# EAGLE design 8-Bit Instruction Register Part 3 (EAGLE 7.5.0)
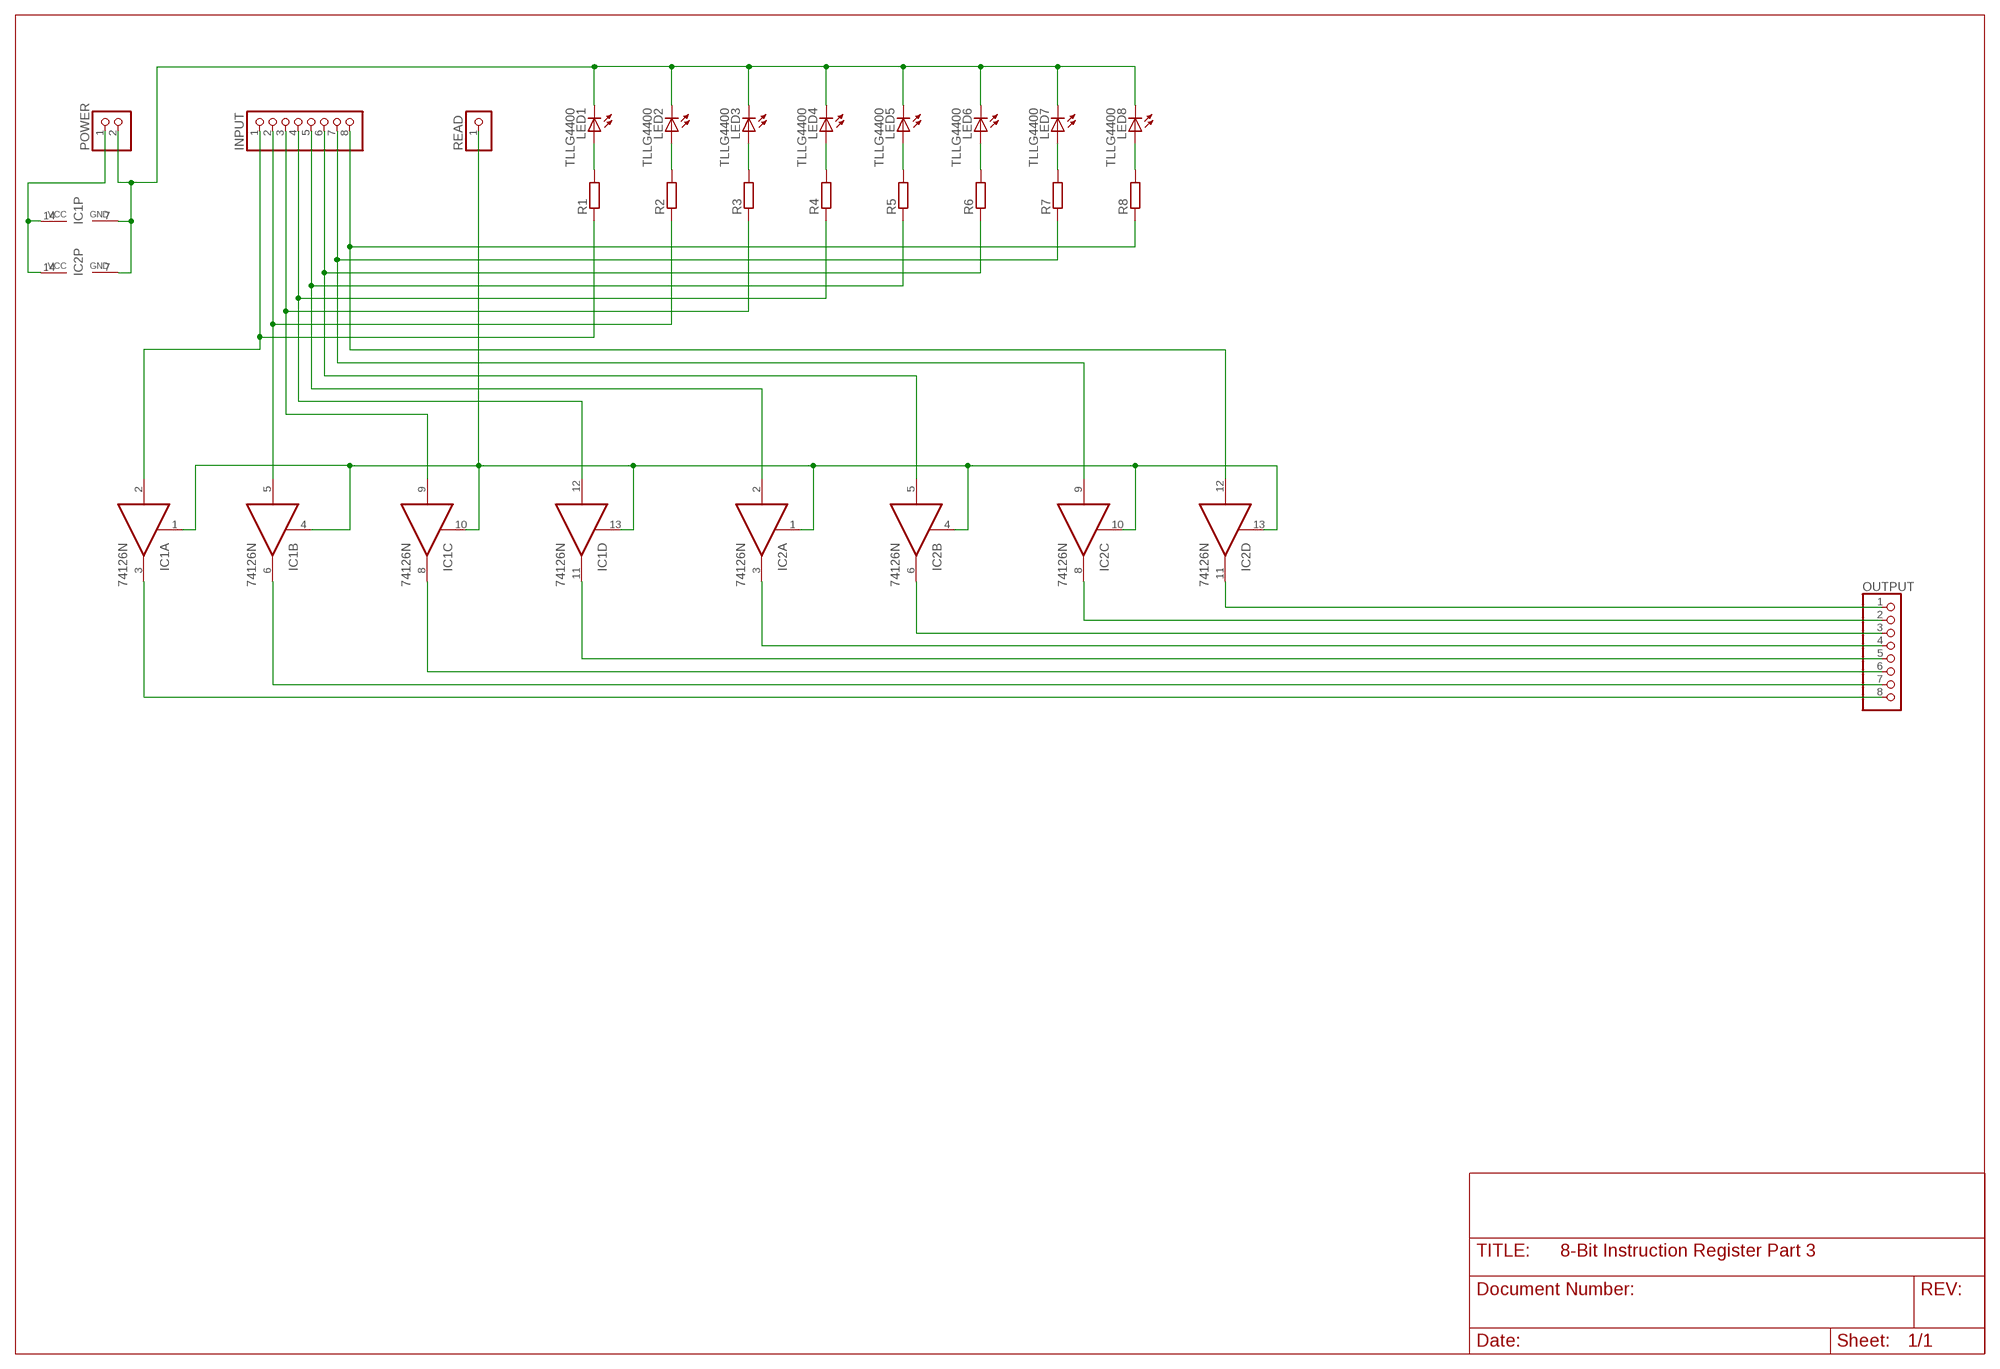
[diagram p0: schematic, sheet 1]

## Parts
IC1  74126N  [DIL14]
IC2  74126N  [DIL14]
INPUT  PINHD-1X8  [1X08]
LED1  TLLG4400  [LED3MM]
LED2  TLLG4400  [LED3MM]
LED3  TLLG4400  [LED3MM]
LED4  TLLG4400  [LED3MM]
LED5  TLLG4400  [LED3MM]
LED6  TLLG4400  [LED3MM]
LED7  TLLG4400  [LED3MM]
LED8  TLLG4400  [LED3MM]
OUTPUT  PINHD-1X8  [1X08]
POWER  PINHD-1X2  [1X02]
R1  R-EU_0207/7  [0207/7]
R2  R-EU_0207/7  [0207/7]
R3  R-EU_0207/7  [0207/7]
R4  R-EU_0207/7  [0207/7]
R5  R-EU_0207/7  [0207/7]
R6  R-EU_0207/7  [0207/7]
R7  R-EU_0207/7  [0207/7]
R8  R-EU_0207/7  [0207/7]
READ  PINHD-1X1  [1X01]

## Nets
GND: IC1.7(P:GND) IC2.7(P:GND) LED1.K(C) LED2.K(C) LED3.K(C) LED4.K(C) LED5.K(C) LED6.K(C) LED7.K(C) LED8.K(C) POWER.2
N$1: IC1.2(A:I) INPUT.1 R1.1
N$2: IC1.5(B:I) INPUT.2 R2.1
N$3: IC1.9(C:I) INPUT.3 R3.1
N$4: IC1.12(D:I) INPUT.4 R4.1
N$5: IC2.2(A:I) INPUT.5 R5.1
N$6: IC2.5(B:I) INPUT.6 R6.1
N$7: IC2.9(C:I) INPUT.7 R7.1
N$8: IC2.12(D:I) INPUT.8 R8.1
N$9: LED1.A R1.2
N$10: IC1.1(A:OE) IC1.4(B:OE) IC1.10(C:OE) IC1.13(D:OE) IC2.1(A:OE) IC2.4(B:OE) IC2.10(C:OE) IC2.13(D:OE) READ.1
N$11: IC1.3(A:O) OUTPUT.8
N$12: IC1.6(B:O) OUTPUT.7
N$13: IC1.8(C:O) OUTPUT.6
N$14: IC1.11(D:O) OUTPUT.5
N$15: IC2.3(A:O) OUTPUT.4
N$16: IC2.6(B:O) OUTPUT.3
N$17: IC2.8(C:O) OUTPUT.2
N$18: IC2.11(D:O) OUTPUT.1
N$19: LED2.A R2.2
N$20: LED3.A R3.2
N$21: LED4.A R4.2
N$22: LED5.A R5.2
N$23: LED6.A R6.2
N$24: LED7.A R7.2
N$25: LED8.A R8.2
VCC: IC1.14(P:VCC) IC2.14(P:VCC) POWER.1

## Library data of the parts
IC1 IC2 = 74xx-eu:74*126: Quad bus BUFFER, 3-state
INPUT OUTPUT = pinhead:PINHD-1X8: PIN HEADER
LED1-LED8 = led:TLLG4400: Low Current (2mA) LED 3 mm Tinted Diffused Package color GREEN Source: Data sheet <http://www.farnell.com/datasheets/391098.pdf>; MF: VISHAY SEMICONDUCTOR; OC_FARNELL: 1612435
POWER = pinhead:PINHD-1X2: PIN HEADER
R1-R8 = resistor:R-EU_: RESISTOR, European symbol
READ = pinhead:PINHD-1X1: PIN HEADER

## Board
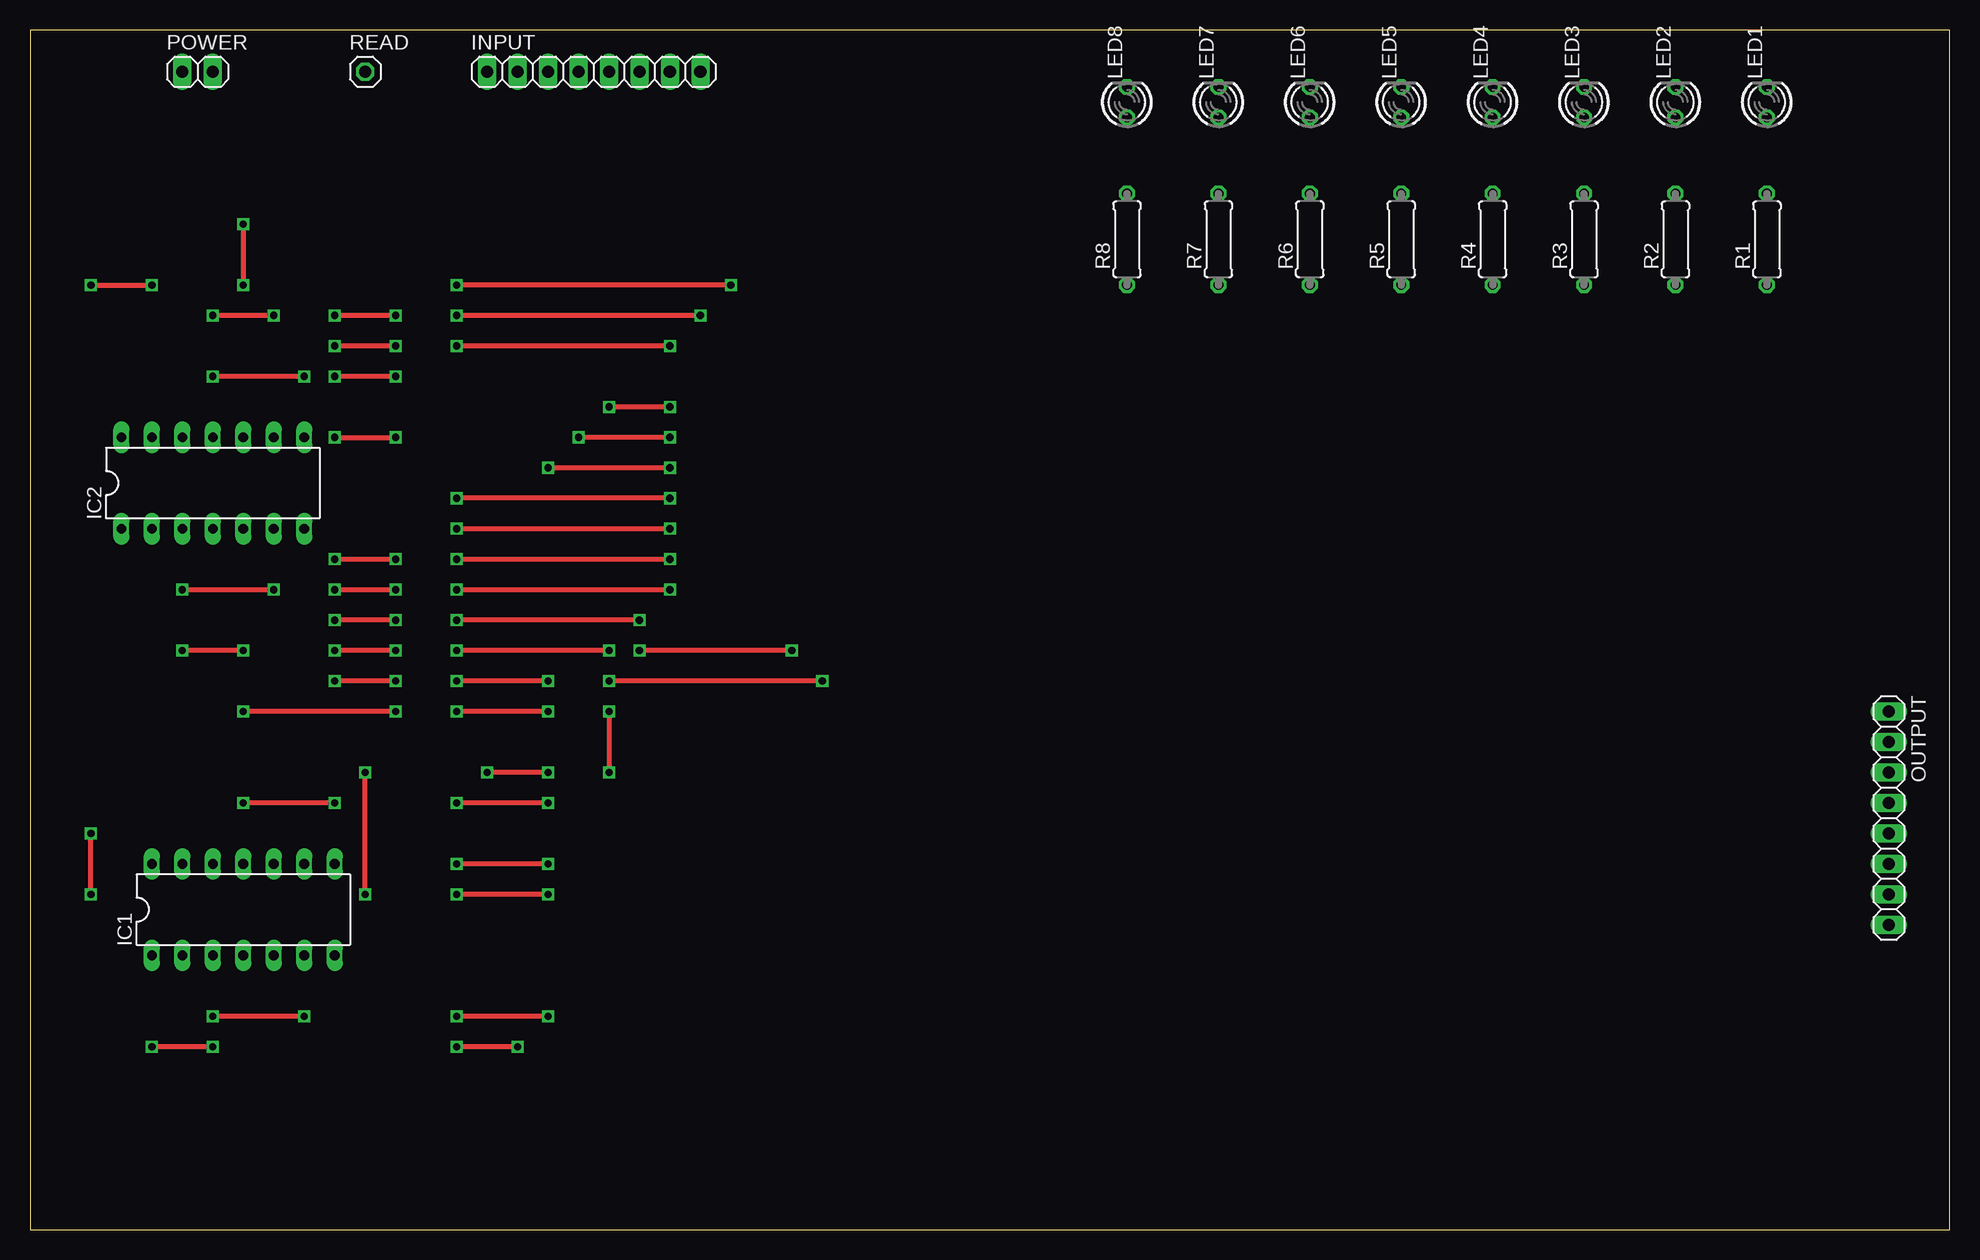
[diagram p1: board, top side]
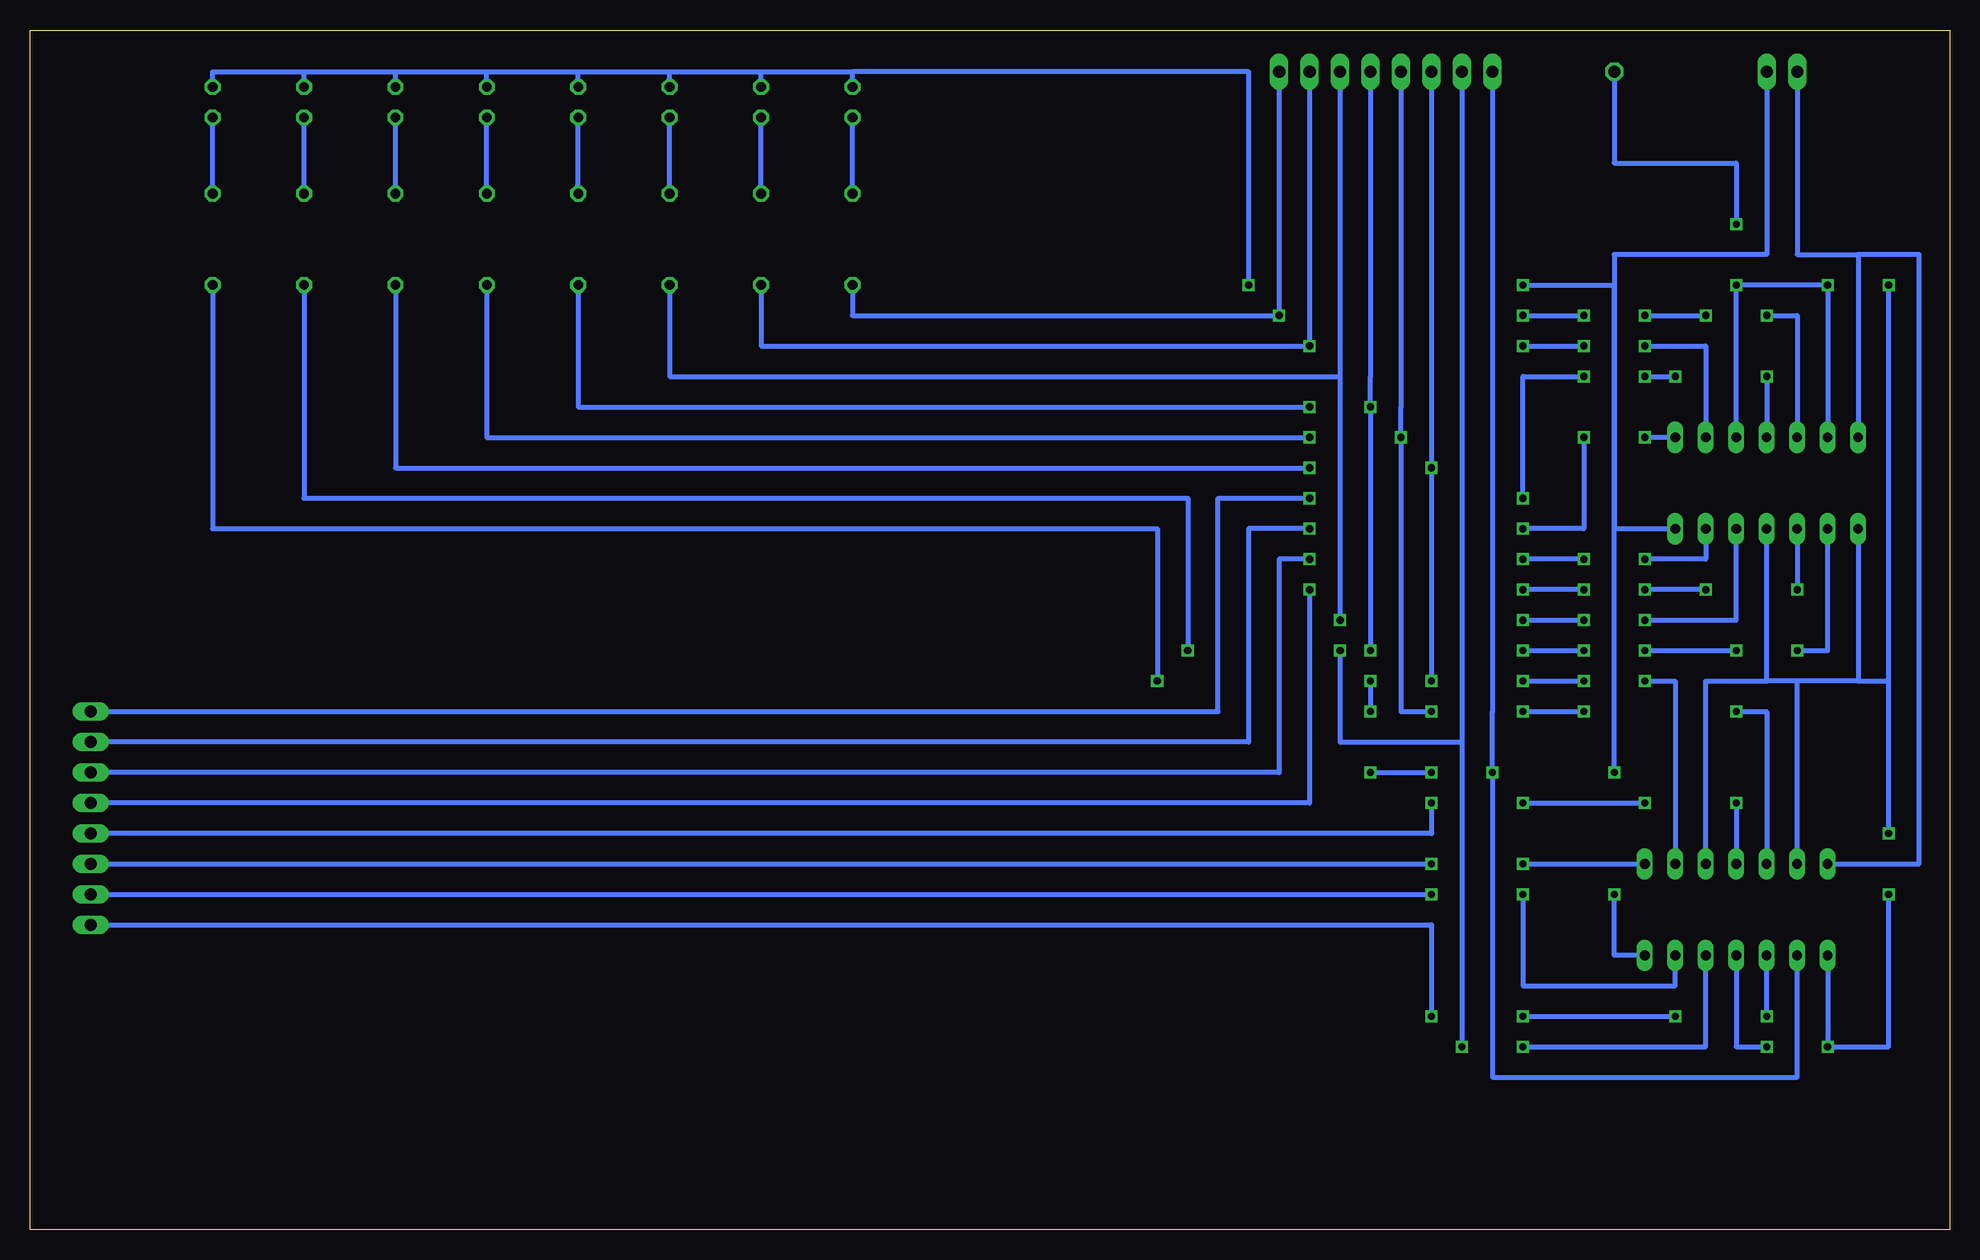
[diagram p2: board, bottom side, seen from below]

Size 160 x 100 mm. Coordinates in mm from the lower left corner, seen from the top.
Outline: 0,0 160,0 160,100 0,100 0,0
Copper layers (1*16): Top 0.035mm / dielectric 1.5mm / Bottom 0.035mm
Design rules "default": minimum track width 10mil, minimum drill 24mil, track to track 8mil, track to pad 8mil, pad to pad 8mil, via to via 8mil, smd to smd 8mil, copper to edge 40mil, drill to drill 8mil, minimum pad ring 10mil, minimum via ring 8mil, stop-mask expansion 4mil, vias tented up to drill 0mil, thermal gap 10mil

### Footprints (pad centres in the part's own frame; a part is rotated, then mirrored left to right if it is on the bottom)
DIL14 = drill 0.813 long: 1 -7.62,-3.81; 2 -5.08,-3.81; 3 -2.54,-3.81; 4 0,-3.81; 5 2.54,-3.81; 6 5.08,-3.81; 7 7.62,-3.81; 8 7.62,3.81; 9 5.08,3.81; 10 2.54,3.81; 11 0,3.81; 12 -2.54,3.81; 13 -5.08,3.81; 14 -7.62,3.81
1X08 = drill 1.016 long: 1 -8.89,0; 2 -6.35,0; 3 -3.81,0; 4 -1.27,0; 5 1.27,0; 6 3.81,0; 7 6.35,0; 8 8.89,0
LED3MM = drill 0.813 octagon: A -1.27,0; K 1.27,0
1X02 = drill 1.016 long: 1 -1.27,0; 2 1.27,0
0207/7 = drill 0.813 octagon: 1 -3.81,0; 2 3.81,0
1X01 = drill 1.016 octagon: 1 0,0

### Placement (x,y rotation side)
IC1  17.78,26.67 0 top
IC2  15.24,62.23 0 top
INPUT  46.99,96.52 0 top
LED1  144.78,93.98 90 top
LED2  137.16,93.98 90 top
LED3  129.54,93.98 90 top
LED4  121.92,93.98 90 top
LED5  114.3,93.98 90 top
LED6  106.68,93.98 90 top
LED7  99.06,93.98 90 top
LED8  91.44,93.98 90 top
OUTPUT  154.94,34.29 270 top
POWER  13.97,96.52 0 top
R1  144.78,82.55 90 top
R2  137.16,82.55 90 top
R3  129.54,82.55 90 top
R4  121.92,82.55 90 top
R5  114.3,82.55 90 top
R6  106.68,82.55 90 top
R7  99.06,82.55 90 top
R8  91.44,82.55 90 top
READ  27.94,96.52 0 top

### Tracks (layer width: path | path; a pad name or v marks a point on that pad's centre or on a via)
GND  (via drill 0.6)
  Top 0.406: v27.94,27.94 v27.94,38.1 | v58.42,78.74 v35.56,78.74
  Bottom 0.406: 27.94,78.74 27.94,81.28 15.24,81.28 POWER.2 | v27.94,38.1 27.94,78.74 | LED1.K 144.78,96.52 137.16,96.52 | 137.16,96.52 129.54,96.52 | 129.54,96.52 121.92,96.52 | 121.92,96.52 114.3,96.52 | 114.3,96.52 106.68,96.52 | 106.68,96.52 99.06,96.52 | 99.06,96.52 93.98,96.52 91.44,96.52 | v58.42,78.74 58.42,96.52 91.44,96.52 | v35.56,78.74 27.94,78.74 | LED8.K 91.44,96.52 | LED7.K 99.06,96.52 | LED6.K 106.68,96.52 | LED5.K 114.3,96.52 | LED4.K 121.92,96.52 | LED3.K 129.54,96.52 | LED2.K 137.16,96.52 | IC1.7 27.94,22.86 v27.94,27.94 | 27.94,78.74 27.94,58.42 IC2.7
N$1  (via drill 0.6)
  Top 0.406: v66.04,45.72 v48.26,45.72 | v48.26,43.18 v48.26,38.1 | v43.18,38.1 v38.1,38.1
  Bottom 0.406: INPUT.1 38.1,43.18 v38.1,38.1 38.1,12.7 12.7,12.7 IC1.2 | R1.1 144.78,58.42 66.04,58.42 v66.04,45.72 | v48.26,45.72 v48.26,43.18 | v48.26,38.1 v43.18,38.1
N$2  (via drill 0.6)
  Top 0.406: v40.64,15.24 v35.56,15.24 | v63.5,48.26 v50.8,48.26
  Bottom 0.406: INPUT.2 40.64,40.64 | 40.64,40.64 v40.64,15.24 | v35.56,15.24 20.32,15.24 IC1.5 | R2.1 137.16,60.96 63.5,60.96 v63.5,48.26 | v50.8,48.26 50.8,40.64 40.64,40.64
N$3  (via drill 0.6)
  Top 0.406: v43.18,45.72 v35.56,45.72 | v30.48,45.72 v25.4,45.72 | v53.34,63.5 v43.18,63.5
  Bottom 0.406: INPUT.3 v43.18,63.5 v43.18,45.72 | v35.56,45.72 v30.48,45.72 | v25.4,45.72 22.86,45.72 IC1.9 | R3.1 129.54,63.5 v53.34,63.5
N$4  (via drill 0.6)
  Top 0.406: v43.18,43.18 v35.56,43.18 | v30.48,43.18 v17.78,43.18 | v53.34,66.04 v45.72,66.04
  Bottom 0.406: INPUT.4 45.72,68.58 v45.72,66.04 45.72,43.18 v43.18,43.18 | v35.56,43.18 v30.48,43.18 | v17.78,43.18 15.24,43.18 IC1.12 | R4.1 121.92,66.04 v53.34,66.04
N$5  (via drill 0.6)
  Top 0.406: v48.26,48.26 v35.56,48.26 | v30.48,48.26 v25.4,48.26 | v17.78,48.26 v12.7,48.26 | v53.34,68.58 v48.26,68.58
  Bottom 0.406: INPUT.5 48.26,71.12 v48.26,68.58 v48.26,48.26 | v35.56,48.26 v30.48,48.26 | v25.4,48.26 v17.78,48.26 | v12.7,48.26 10.16,48.26 IC2.2 | R5.1 114.3,68.58 v53.34,68.58
N$6  (via drill 0.6)
  Top 0.406: v50.8,50.8 v35.56,50.8 | v30.48,50.8 v25.4,50.8
  Bottom 0.406: INPUT.6 50.8,71.12 | 50.8,71.12 v50.8,50.8 | v35.56,50.8 v30.48,50.8 | v25.4,50.8 17.78,50.8 IC2.5 | R6.1 106.68,71.12 50.8,71.12
N$7  (via drill 0.6)
  Top 0.406: v53.34,73.66 v35.56,73.66 | v30.48,73.66 v25.4,73.66
  Bottom 0.406: INPUT.7 v53.34,73.66 99.06,73.66 R7.1 | v35.56,73.66 v30.48,73.66 | v25.4,73.66 20.32,73.66 IC2.9
N$8  (via drill 0.6)
  Top 0.406: v55.88,76.2 v35.56,76.2 | v30.48,76.2 v25.4,76.2 | v20.32,76.2 v15.24,76.2
  Bottom 0.406: v35.56,76.2 v30.48,76.2 | v25.4,76.2 v20.32,76.2 | v15.24,76.2 12.7,76.2 IC2.12 | INPUT.8 v55.88,76.2 91.44,76.2 R8.1
N$9
  Bottom 0.406: R1.2 LED1.A
N$10  (via drill 0.6)
  Top 0.406: v17.78,83.82 v17.78,78.74 | v5.08,78.74 v10.16,78.74 | v5.08,27.94 v5.08,33.02 | v15.24,15.24 v10.16,15.24
  Bottom 0.406: v17.78,83.82 17.78,88.9 27.94,88.9 READ.1 | IC2.13 v10.16,78.74 v17.78,78.74 IC2.10 | IC2.1 7.62,45.72 | 7.62,45.72 5.08,45.72 | 5.08,45.72 v5.08,78.74 | 7.62,45.72 12.7,45.72 | 12.7,45.72 15.24,45.72 | 15.24,45.72 IC2.4 | IC1.13 12.7,45.72 | IC1.10 20.32,45.72 15.24,45.72 | IC1.1 v10.16,15.24 5.08,15.24 v5.08,27.94 | v5.08,33.02 5.08,45.72 | IC1.4 17.78,15.24 v15.24,15.24
N$11  (via drill 0.6)
  Top 0.406: v43.18,17.78 v35.56,17.78 | v22.86,17.78 v15.24,17.78
  Bottom 0.406: OUTPUT.8 43.18,25.4 v43.18,17.78 | v35.56,17.78 v22.86,17.78 | v15.24,17.78 IC1.3
N$12  (via drill 0.6)
  Top 0.406: v43.18,27.94 v35.56,27.94
  Bottom 0.406: OUTPUT.7 v43.18,27.94 | v35.56,27.94 35.56,20.32 22.86,20.32 IC1.6
N$13  (via drill 0.6)
  Top 0.406: v43.18,30.48 v35.56,30.48
  Bottom 0.406: OUTPUT.6 v43.18,30.48 | v35.56,30.48 IC1.8
N$14  (via drill 0.6)
  Top 0.406: v25.4,35.56 v17.78,35.56 | v43.18,35.56 v35.56,35.56
  Bottom 0.406: v35.56,35.56 v25.4,35.56 | v17.78,35.56 IC1.11 | v43.18,35.56 43.18,33.02 OUTPUT.5
N$15  (via drill 0.6)
  Top 0.406: v12.7,53.34 v20.32,53.34 | v25.4,53.34 v30.48,53.34 | v35.56,53.34 v53.34,53.34
  Bottom 0.406: IC2.3 v12.7,53.34 | v20.32,53.34 v25.4,53.34 | v30.48,53.34 v35.56,53.34 | v53.34,53.34 53.34,35.56 OUTPUT.4
N$16  (via drill 0.6)
  Top 0.406: v25.4,55.88 v30.48,55.88 | v35.56,55.88 v53.34,55.88
  Bottom 0.406: IC2.6 20.32,55.88 v25.4,55.88 | v30.48,55.88 v35.56,55.88 | v53.34,55.88 55.88,55.88 55.88,38.1 OUTPUT.3
N$17  (via drill 0.6)
  Top 0.406: v25.4,66.04 v30.48,66.04 | v35.56,58.42 v53.34,58.42
  Bottom 0.406: IC2.8 v25.4,66.04 | v30.48,66.04 30.48,58.42 v35.56,58.42 | v53.34,58.42 58.42,58.42 58.42,40.64 OUTPUT.2
N$18  (via drill 0.6)
  Top 0.406: v53.34,60.96 v35.56,60.96 | v30.48,71.12 v25.4,71.12 | v22.86,71.12 v15.24,71.12
  Bottom 0.406: OUTPUT.1 60.96,43.18 60.96,60.96 v53.34,60.96 | v35.56,60.96 35.56,71.12 v30.48,71.12 | v25.4,71.12 v22.86,71.12 | v15.24,71.12 IC2.11
N$19
  Bottom 0.406: R2.2 LED2.A
N$20
  Bottom 0.406: R3.2 LED3.A
N$21
  Bottom 0.406: R4.2 LED4.A
N$22
  Bottom 0.406: R5.2 LED5.A
N$23
  Bottom 0.406: R6.2 LED6.A
N$24
  Bottom 0.406: R7.2 LED7.A
N$25
  Bottom 0.406: R8.2 LED8.A
VCC
  Bottom 0.406: POWER.1 12.7,81.28 7.62,81.28 | 7.62,81.28 IC2.14 | IC1.14 2.54,30.48 2.54,81.28 7.62,81.28